# EAGLE design openservo-small (EAGLE 4.16)
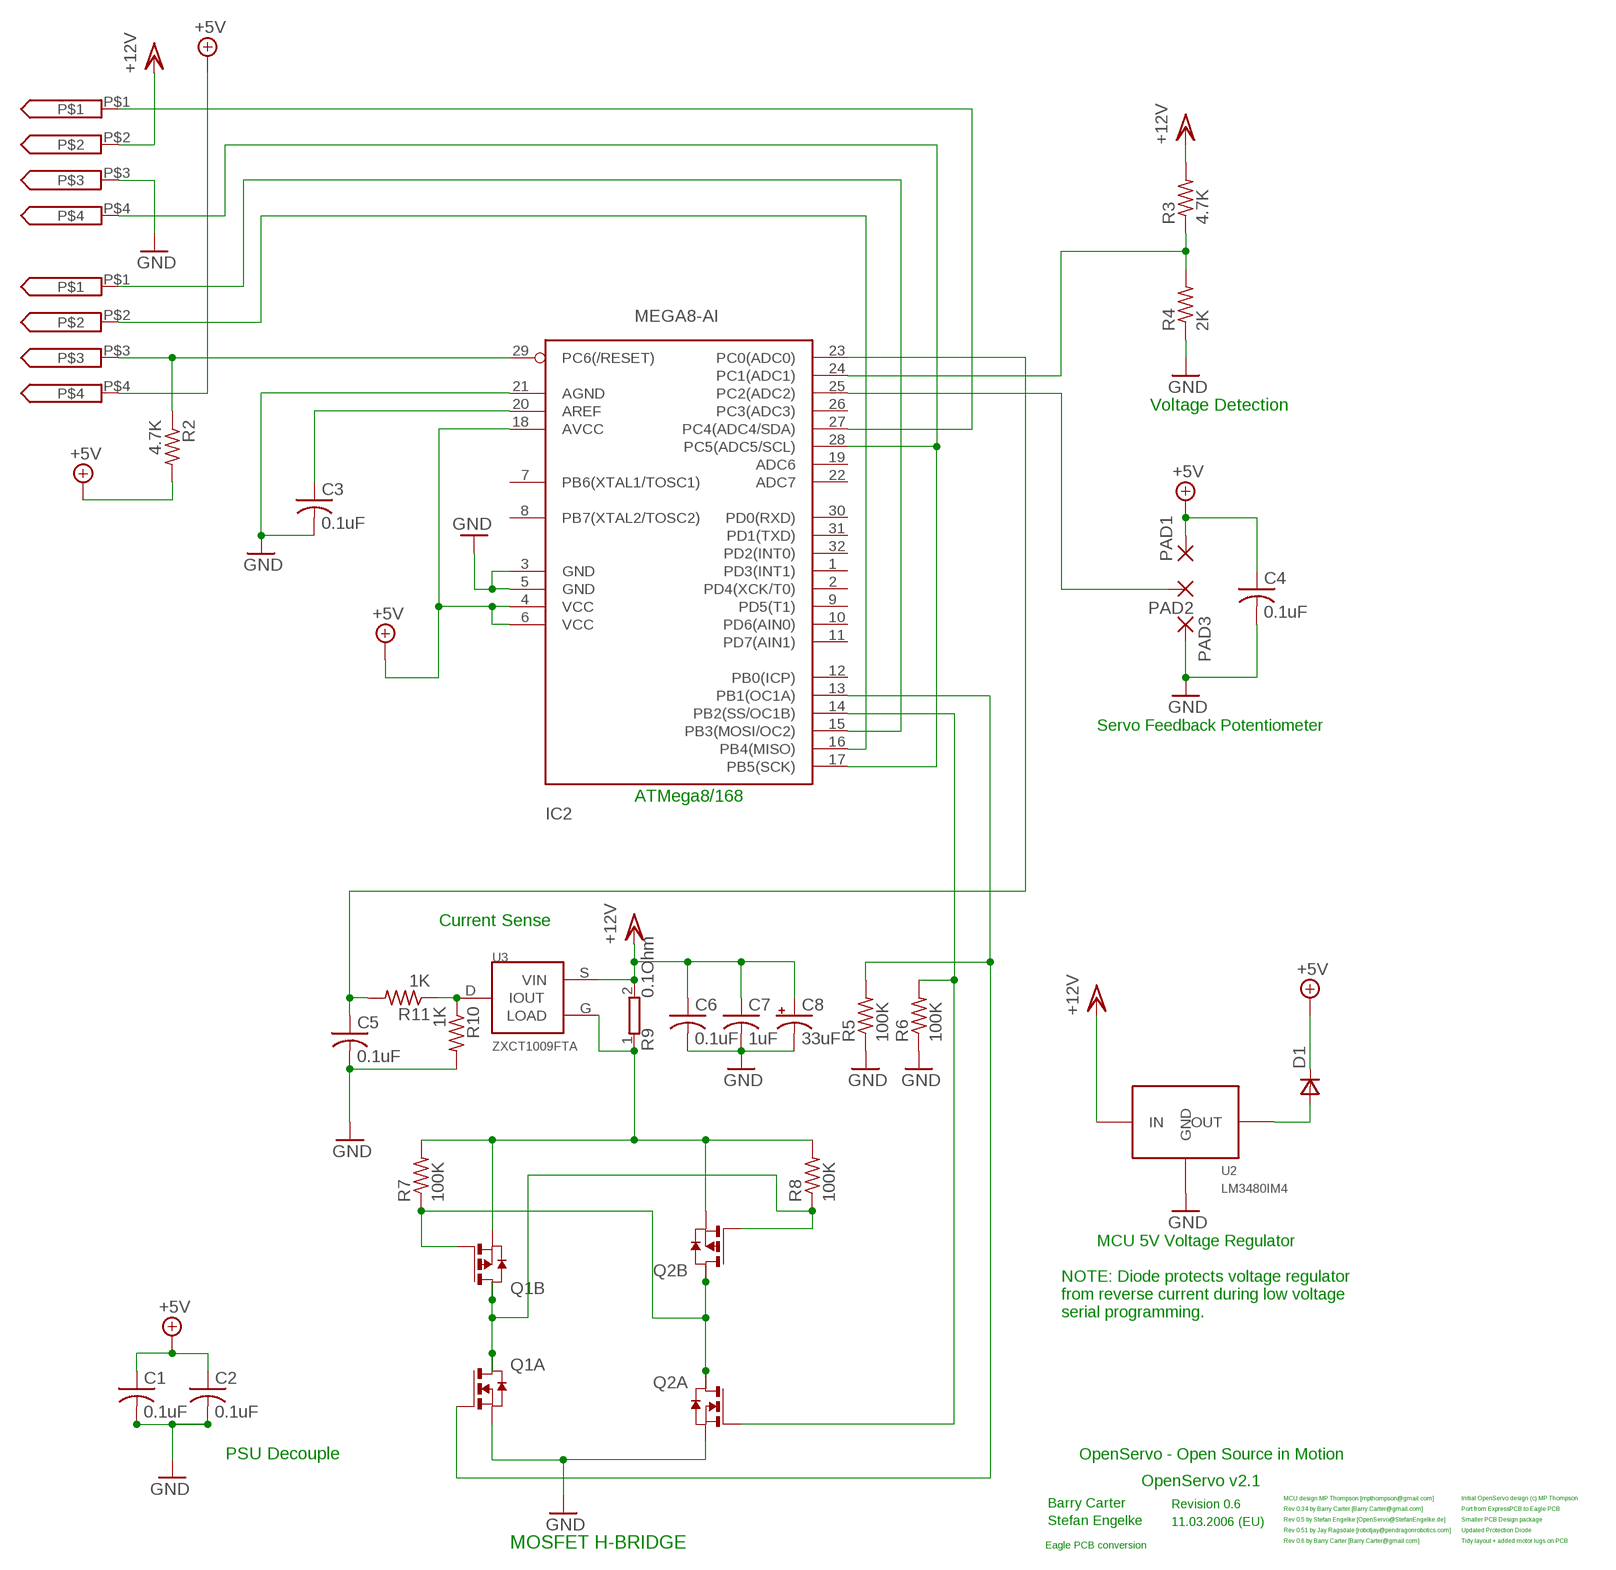
[diagram p0: schematic, sheet 1]

## Parts
C1  0.1uF  C-USC0603  [C0603]
C2  0.1uF  C-USC0603  [C0603]
C3  0.1uF  C-USC0603  [C0603]
C4  0.1uF  C-USC0603  [C0603]
C5  0.1uF  C-USC0603K  [C0603K]
C6  0.1uF  C-USC0603  [C0603]
C7  1uF  C-USC0603  [C0603]
C8  33uF  CPOL-US153CLV-0405  [153CLV-0405]
D1  DSOD323  [SOD323]
IC2  MEGA8-AI  [TQFP32-08]
PAD1  1,6/0,9  [1,6/0,9]
PAD2  1,6/0,9  [1,6/0,9]
PAD3  1,6/0,9  [1,6/0,9]
Q1  PN_MOSFET-SO8  [SO8]
Q2  PN_MOSFET-SO8  [SO8]
R2  4.7K  R-US_R0603  [R0603]
R3  4.7K  R-US_R0603  [R0603]
R4  2K  R-US_R0603  [R0603]
R5  100K  R-US_R0603  [R0603]
R6  100K  R-US_R0603  [R0603]
R7  100K  R-US_R0603  [R0603]
R8  100K  R-US_R0603  [R0603]
R9  0.1Ohm  R1206W  [R1206W]
R10  1K  R-US_R0603  [R0603]
R11  1K  R-US_R0603  [R0603]
U2  LM3480IM4  [SOT-3]
U3  ZXCT1009FTA  [SOT-3]
U$1  4-EDGEVERSION2  4-EDGE  [4-PIN-EDGE]
U$2  4-EDGEVERSION2  4-EDGE  [4-PIN-EDGE]

## Nets
+5V: C1.1 C2.1 C4.1 D1.1(C) IC2.4(VCC) IC2.6(VCC) IC2.18(AVCC) PAD1.1(P) R2.2 U$2.P$4
CURSENSE: C5.1 IC2.23(PC0(ADC0)) R11.2
GND: C1.2 C2.2 C3.2 C4.2 C5.2 C6.2 C7.2 C8.- IC2.3(GND) IC2.5(GND) IC2.21(AGND) PAD3.1(P) Q1.1(A:S) Q2.1(A:S) R4.1 R5.1 R6.1 R10.2 U2.D(GND) U$1.P$3
MISO: IC2.16(PB4(MISO)) U$2.P$2
MOSI: IC2.15(PB3(MOSI/OC2)) U$2.P$1
N$1: D1.2(A) U2.G(OUT)
N$4: Q1.4(B:G) Q2.5(B:D) Q2.6(B:D2) Q2.7(A:D) Q2.8(A:D2) R7.1
N$5: Q1.5(B:D) Q1.6(B:D2) Q1.7(A:D) Q1.8(A:D2) Q2.4(B:G) R8.1
N$10: Q1.3(B:S) Q2.3(B:S) R7.2 R8.2 R9.1 U3.G(LOAD)
N$11: IC2.14(PB2(SS/OC1B)) Q2.2(A:G) R6.2
N$12: R10.1 R11.1 U3.D(IOUT)
N$19: IC2.13(PB1(OC1A)) Q1.2(A:G) R5.2
N$21: C3.1 IC2.20(AREF)
POT: IC2.25(PC2(ADC2)) PAD2.1(P)
RESET: IC2.29(PC6(/RESET)) R2.1 U$2.P$3
SCK/SCL: IC2.17(PB5(SCK)) IC2.28(PC5(ADC5/SCL)) U$1.P$4
SDA: IC2.27(PC4(ADC4/SDA)) U$1.P$1
VCC/2: C6.1 C7.1 C8.+ R3.2 R9.2 U2.S(IN) U3.S(VIN) U$1.P$2 ; supply symbol labelled +12V
VOLTSENSE: IC2.24(PC1(ADC1)) R3.1 R4.2
Unconnected: IC2.1(PD3(INT1)) IC2.2(PD4(XCK/T0)) IC2.7(PB6(XTAL1/TOSC1)) IC2.8(PB7(XTAL2/TOSC2)) IC2.9(PD5(T1)) IC2.10(PD6(AIN0)) IC2.11(PD7(AIN1)) IC2.12(PB0(ICP)) IC2.19(ADC6) IC2.22(ADC7) IC2.26(PC3(ADC3)) IC2.30(PD0(RXD)) IC2.31(PD1(TXD)) IC2.32(PD2(INT0))

## Notes on the sheet
- Voltage Detection
- Servo Feedback Potentiometer
- ATMega8/168
- Current Sense
- MCU 5V Voltage Regulator
- NOTE: Diode protects voltage regulator
- from reverse current during low voltage
- serial programming.
- PSU Decouple | OpenServo - Open Source in Motion
- OpenServo v2.1
- MCU design MP Thompson [mpthompson@gmail.com] | Initial OpenServo design (c) MP Thompson
- Barry Carter | Revision 0.6
- Rev 0.34 by Barry Carter [Barry.Carter@gmail.com] | Port from ExpressPCB to Eagle PCB
- Rev 0.5 by Stefan Engelke [OpenServo@StefanEngelke.de] | Smaller PCB Design package
- Stefan Engelke | 11.03.2006 (EU)
- Rev 0.51 by Jay Ragsdale [robotjay@pendragonrobotics.com] | Updated Protection Diode
- Rev 0.6 by Barry Carter [Barry.Carter@gmail.com] | Tidy layout + added motor lugs on PCB
- MOSFET H-BRIDGE | Eagle PCB conversion

## Library data of the parts
C1-C7 = rcl:C-US: CAPACITOR, American symbol
C8 = rcl:CPOL-US: POLARIZED CAPACITOR, American symbol
D1 = zetex:D: DIODE
IC2 = atmel:MEGA8: MICROCONTROLLER 8 Kbytes FLASH 1 kbytes SRAM 512 bytes EEPROM USART 6-channel 10 bit ADC 2-channel 8 bit ADC Source: avr.lbr
PAD1-PAD3 = wirepad:1,6/0,9: THROUGH-HOLE PAD
Q1 Q2 = zetex:PN_MOSFET-: DUAL N AND P-CHANNEL ENHANCEMENT MODE MOSFET source ZXMD63C02.pdf from http://www.zetex.com/
R2-R8 R10 R11 = rcl:R-US_: RESISTOR, American symbol
R9 = openservo:R1206W
U2 = openservo:LM3480IM4
U3 = openservo:ZXCT1009FTA
U$1 U$2 = openservo:4-EDGE

## Board
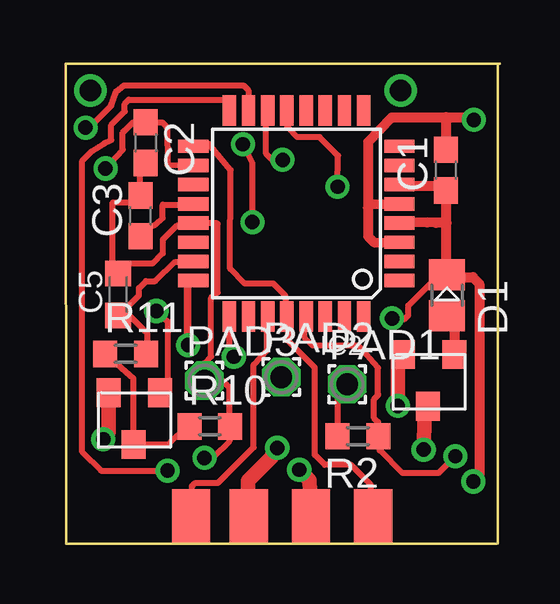
[diagram p1: board, top side]
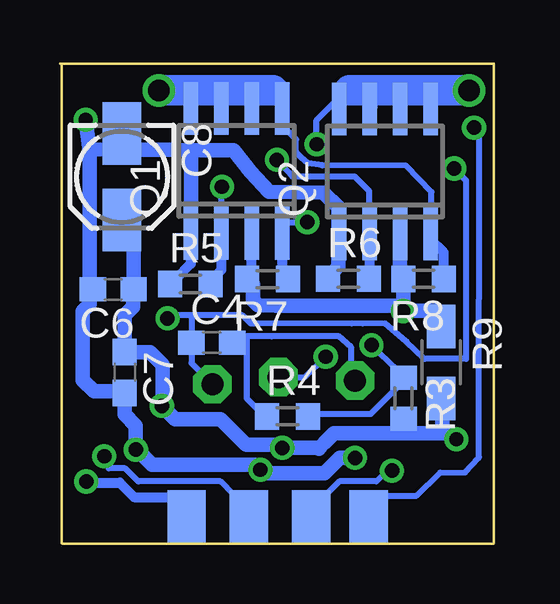
[diagram p2: board, bottom side, seen from below]

Size 18.1 x 19.99 mm. Coordinates in mm from the lower left corner, seen from the top.
Outline: 0.02,0 17.99,0
Outline: 0,19.87 0.01,0.03
Outline: 18.02,19.91 18.03,13.53
Outline: 18.03,13.53 18.03,13.5
Outline: 18.03,13.53 18.03,0
Outline: 18.1,19.99 0,19.99 0,19.87
Outline: 0,19.87 0,19.83
Copper layers (1*16): Top 0.035mm / dielectric 1.5mm / Bottom 0.035mm
Design rules "8mils": minimum track width 10mil, minimum drill 0.6mm, track to track 8mil, track to pad 8mil, pad to pad 8mil, via to via 8mil, smd to smd 8mil, copper to edge 10mil, drill to drill 10mil, minimum pad ring 10mil, minimum via ring 8mil, stop-mask expansion 0mil, vias tented up to drill 0mil, thermal gap 10mil
tKeepout: area 0.1,0 to 2.1,2; area 15.8,0 to 17.8,2

### Footprints (pad centres in the part's own frame; a part is rotated, then mirrored left to right if it is on the bottom)
C0603 = smd 1.1 x 1: 1 -0.85,0; 2 0.85,0
C0603K = smd 1.05 x 1.08: 1 -0.875,0; 2 0.875,0
153CLV-0405 = smd 2.6 x 1.6: + 1.8,0; - -1.8,0
C0805 = smd 1.3 x 1.5: 1 -0.85,0; 2 0.85,0
TQFP32-08 = smd 1.27 x 0.559: 1 -4.293,2.8; 2 -4.293,2; 3 -4.293,1.2; 4 -4.293,0.4; 5 -4.293,-0.4; 6 -4.293,-1.2; 7 -4.293,-2; 8 -4.293,-2.8; 17 4.293,-2.8; 18 4.293,-2; 19 4.293,-1.2; 20 4.293,-0.4; 21 4.293,0.4; 22 4.293,1.2; 23 4.293,2; 24 4.293,2.8 | smd 0.559 x 1.27: 9 -2.8,-4.293; 10 -2,-4.293; 11 -1.2,-4.293; 12 -0.4,-4.293; 13 0.4,-4.293; 14 1.2,-4.293; 15 2,-4.293; 16 2.8,-4.293; 25 2.8,4.293; 26 2,4.293; 27 1.2,4.293; 28 0.4,4.293; 29 -0.4,4.293; 30 -1.2,4.293; 31 -2,4.293; 32 -2.8,4.293
1,6/0,9 = drill 0.914 pad 1.6 octagon: 1 0,0
SO8 = smd 0.6 x 2.2: 1 -1.905,-2.6; 2 -0.635,-2.6; 3 0.635,-2.6; 4 1.905,-2.6; 5 1.905,2.6; 6 0.635,2.6; 7 -0.635,2.6; 8 -1.905,2.6
R0603 = smd 1 x 1.1: 1 -0.85,0; 2 0.85,0
R1206W = smd 1.8 x 1.2: 1 -1.499,0; 2 1.499,0
SOT-3 = smd 1 x 1.2: D -0.038,-0.927; G 1.067,1.232; S -1.079,1.232
4-PIN-EDGE = smd 2.2 x 1.6: P$1 1.2,4.2; P$2 1.2,1.8; P$3 1.2,-0.8; P$4 1.2,-3.4

### Placement (x,y rotation side)
C1  15.86,15.56 90 top
C2  3.34,16.7 270 top
C3  3.12,13.65 90 top
C4  11.76,8.37 0 bottom
C5  2.19,10.38 90 top
C6  15.87,10.6 180 bottom
C7  15.4,7.13 270 bottom
C8  15.51,15.29 270 bottom
D1  [C0805]  15.9,10.35 270 top
IC2  9.63,13.75 180 top
PAD1  11.74,6.64 0 top
PAD2  8.99,6.94 0 top
PAD3  5.79,6.79 0 top
Q1  10.73,15.53 0 bottom
Q2  4.55,15.5 0 bottom
R2  12.19,4.47 180 top
R3  3.77,6.06 270 bottom
R4  8.61,5.3 0 bottom
R5  12.66,10.82 0 bottom
R6  6.06,11.03 0 bottom
R7  9.44,11.02 180 bottom
R8  2.93,11.03 180 bottom
R9  2.2,7.55 270 bottom
R10  6.01,4.88 0 top
R11  2.5,7.91 0 top
U2  15.15,6.65 0 top
U3  2.86,5.06 0 top
U$1  9.43,-0.04 90 top
U$2  9.42,2.33 270 bottom

### Tracks (layer width: path | path; a pad name or v marks a point on that pad's centre or on a via)
+5V  (via drill 0.6)
  Top 0.254: IC2.18 4.24,15.78 4.23,17.33 4.23,17.35 4.02,17.55 C2.1 2.8,17.55 2.46,17.21 2.38,17.13 2.38,16.42 v1.66,15.63 | v13.61,9.38 14.13,9.35 14.29,9.51 14.29,9.91 15.31,10.94 | 15.45,11.13 15.45,11.14 | 15.45,11.13 15.88,11.34 | 15.31,10.94 15.45,11.08 15.45,11.13 | PAD1.1 11.75,6.66 | PAD1.1 | R2.2 11.34,6.25 PAD1.1 | D1.1 15.9,11.12 15.71,10.94 15.31,10.94
  Top 0.406: 15.88,11.34 15.51,10.95 | 15.88,11.34 15.53,11.03 | 15.88,11.34 15.88,13.36 | 15.88,13.36 15.88,14.63 | 15.88,14.63 15.8,14.67 | 15.88,13.36 15.46,13.36 15.08,13.38 IC2.4 | 15.79,14.78 15.79,14.89 13.91,14.89 IC2.6 | 15.79,14.78 C1.1 | 15.79,14.78 15.63,14.63 15.88,14.63 | v17,2.59 17.25,2.75 17.25,10.84 16.99,11.1 16.19,11.1 16.03,11.26 15.97,11.2 D1.1
  Bottom 0.254: v1.66,15.63 1.16,15.12 1.16,7.7 2.9,7.7 3.65,8.41 4.55,9.18 5.47,9.17 5.93,9.18 9.99,9.17 10.13,9.17 10.48,9.51 12.7,9.51 | 13.62,9.38 13.65,9.35 | 13.62,9.38 v13.61,9.38 | 12.7,9.51 13.49,9.51 13.62,9.38 | 12.7,9.51 12.61,9.43 C4.1 12.61,7.52 PAD1.1
  Bottom 0.406: U$2.P$4 12.77,0.68 13.3,1.21 13.3,1.74 13.5,1.94 15.01,1.94 15.6,2.54 17,2.54 v17,2.59
CURSENSE
  Top 0.254: IC2.23 5.62,11.74 4.57,11.74 3.73,10.94 3.35,10.94 3.06,10.64 3.06,10.34 2.44,9.72 | C5.1 2.34,9.65 2.34,9.72 2.44,9.72 | R11.2 3.54,8.21 3.39,8.21 3.39,8.76 2.44,9.72
GND  (via drill 0.6)
  Top 0.254: 3.1,14.23 3.15,14.38 C3.2 | C2.2 3.1,15.57 3.1,14.23 | 3.1,14.23 1.97,14.21 1.97,11.35 | C5.2 2.53,11.26 | 1.97,11.35 2.27,11.34 | 6.34,13.32 6.34,10.47 6.07,10.25 6.07,7.8 5.79,7.52 PAD3.1 6.54,6.79 6.83,6.5 6.83,5.07 6.86,5.03 R10.2 6.83,4.91 6.83,4.27 6.12,3.57 v5.79,3.57 | C5.2 2.08,11.35 1.97,11.35 | C5.2 2.2,11.33 2.53,11.66 3.62,11.66 4.05,12.09 4.05,12.66 4.62,13.23 5.18,13.23 5.27,13.32 IC2.21 5.32,13.34 | 5.5,13.39 5.55,13.34 5.35,13.31 5.32,13.34 | 6.34,13.32 6.32,13.34 5.32,13.34 | 5.32,13.34 5.25,13.34 | 6.34,13.32 6.3,13.29 6.3,12.89
  Top 0.406: R10.2 | IC2.3 12.89,12.54 12.61,12.82 12.61,13.92 | 12.61,13.92 12.61,16.73 13.59,17.74 15.88,17.74 | IC2.5 12.65,14.14 12.61,13.92 | v17.02,17.65 17.02,17.65 16.99,17.61 16.85,17.74 15.88,17.74 | 15.88,17.74 15.88,17.77 15.86,17.75 C1.2
  Top 0.6: U$1.P$3 10.17,2.63 9.68,3.13 v9.74,3.07
  Top 0.61: U2.D 14.96,5.3 v14.93,3.92
  Bottom 0.254: 10.31,8.24 10.31,8.63 9.26,8.63 6.45,8.63 5.95,8.18 5.95,6.89 5.85,6.79 PAD3.1 | 10.31,8.24 10.31,6.05 9.5,5.24 9.46,5.28 R4.1 9.49,5.3 9.5,5.29 | 10.31,8.24 10.3,8.24 10.3,8.27 C4.2 | Q2.1 6.35,13.01 6.35,13.44 6.4,13.39 6.4,13.34 | 6.4,13.34 6.4,13.09 6.65,13.34 6.65,13.59 6.4,13.34 | C6.2 16.83,10.62 16.86,10.69
  Bottom 0.406: Q1.1 12.64,12.62 12.64,11.66 13.29,10.99 13.48,10.85 13.5,10.72 R5.1
  Bottom 0.61: C8.- 15.36,16.91 15.71,17.77 | 15.71,17.77 15.15,16.52 | 6.49,13.29 6.49,14.02 7.1,14.62 9.38,14.65 10.15,15.48 10.86,16.4 12.62,16.4 | 6.49,13.29 6.45,13.25 Q2.1 6.45,13.32 6.49,13.29 | R6.1 6.7,11.33 6.49,11.55 6.49,13.29 | 12.62,16.4 13.17,16.41 14.97,16.41 | 14.97,16.41 15.59,17.77 15.71,17.77 | 12.62,16.4 12.69,16.38 12.64,16.33 Q1.1 | 14.97,16.41 16.79,16.42 16.8,16.3 | 16.8,16.3 16.86,16.23 16.86,10.69 | 16.8,16.3 16.86,16.36 v17.02,17.65 | 16.85,10.7 C6.2 | 16.85,10.7 16.8,10.69 | 9.76,3.07 v9.74,3.07 | 9.76,3.07 9.97,3.29 14.25,3.29 14.92,3.96 14.93,3.95 v14.93,3.92 14.93,4.92 15.4,5.38 C7.2 15.5,6.28 15.56,6.34 16.67,6.34 17.14,6.81 17.14,9.67 16.85,9.97 16.85,10.7 | 9.76,3.07 9.6,3.07 9.45,2.92 7.06,2.92 6.42,3.57 v5.79,3.57
MISO  (via drill 0.6)
  Top 0.254: IC2.16 6.74,17.81 6.74,18.48 6.85,17.77 6.95,17.96 6.66,18.5 2.63,18.5 2.46,18.33 2.46,18.01 1.91,17.45 1.91,16.82 1.59,16.66 1.08,16.34 0.7,15.96 0.7,3.81 1.47,3.04 v4.25,3.04
  Bottom 0.254: 7.52,0.64 U$2.P$2 | 7.53,0.71 7.34,0.91 6.95,1.3 6.95,2.09 6.45,2.59 4.9,2.59 4.45,3.04 v4.25,3.04
  Bottom 0.61: 7.52,1.02 7.4,0.91 7.34,0.91 | 7.52,1.02 7.52,0.64 | 7.52,1.02 7.53,1.03
MOSI  (via drill 0.6)
  Top 0.254: IC2.15 7.58,17.81 7.56,18.47 | 7.65,18.34 7.62,18.88 7.41,19.09 2.43,19.09 2.1,18.84 1.91,18.24 1.11,17.45 v0.83,17.33
  Top 0.406: 7.56,18.47 7.6,18.27 7.65,18.34
  Bottom 0.254: 5.03,0.68 U$2.P$1 5.02,1.35 5.12,1.82 5.16,2 3.21,2 2.25,2.94 2.25,2.96 1.21,2.97 0.64,3.57 0.62,3.6 0.61,16.74 0.61,16.95 0.59,17.09 v0.83,17.33 | 4.93,0.71 5,0.64 5.05,0.59
  Bottom 0.61: U$2.P$1 5.04,1.04 5,1.01 5,0.64
N$1
  Top 0.406: 15.9,9.53 D1.2 16.22,8.99 U2.G
N$4  (via drill 0.6, 0.9)
  Top 0.254: v7.79,13.39 7.79,15.86 v7.39,16.64
  Bottom 0.254: Q1.4 8.8,13.72 8.65,13.39 v7.79,13.39 | 6.45,18.59 6.42,18.62 7.39,17.65 v7.39,16.64 | 6.45,18.59 6.03,18.88 | 5.4,18.88 5.25,18.94 | Q2.8 6.51,18.09 6.45,18.59
  Bottom 0.406: R7.1 8.89,10.96 8.72,10.88 8.83,11.33 Q1.4
  Bottom 0.61: Q2.6 3.89,18.7 3.86,18.73 | Q2.8 6.45,18.21 | Q2.7 5.15,18.24 5.15,18.94 5.25,18.94 3.95,18.94 3.9,18.89 3.9,18.22 Q2.6 | Q2.6 3.9,18.94 2.65,18.94 Q2.5
  Bottom 1.27: v1.03,18.88 5.4,18.88 6.03,18.88
N$5  (via drill 0.9)
  Bottom 0.254: Q2.4 2.64,13.39 2.6,13.35 2.6,14.64 3.67,15.74 7.16,15.76 7.75,15.84 8.03,16.08 8.25,16.3 8.25,16.84 8.8,17.39 | 8.89,18.09 Q1.5
  Bottom 0.406: Q2.4 2.64,12.68 2.1,12.13 2.1,11.34 2.08,11.33 R8.1 | Q1.8 12.54,18.09 12.7,18.72 12.7,18.88 | 8.8,17.39 8.89,17.29 8.89,18.09 | Q1.5 8.89,18.24 9.21,18.88 | 10.16,18.88 10.16,18.56 Q1.6 | 11.43,18.88 11.43,18.72 Q1.7
  Bottom 1.27: 9.21,18.88 10.16,18.88 11.43,18.88 12.7,18.88 v13.97,18.88
N$10  (via drill 0.6)
  Top 0.254: U3.G 4.25,6.71 4.25,9.25 v3.78,9.69
  Bottom 0.254: v3.78,9.69 3.87,9.9 | 10.11,13.42 10.14,13.39 10.15,13.39 10.15,12.98 Q1.3
  Bottom 0.406: R7.2 10.1,11.16 10.1,12.19 10.15,12.59 10.15,12.89 10.14,12.89 Q1.3
  Bottom 0.6: 3.8,9.7 3.58,9.7 | 3.8,9.7 3.87,9.9 9.09,9.9 | 3.8,9.7 v3.78,9.69 3.8,11.31 arc90 R8.2 arc90 3.79,11.32 3.91,11.32 Q2.3
  Bottom 0.61: v3.78,9.69 3.75,9.82 3.75,9.69 2.35,9.69 2.35,9.15 R9.1 | 9.09,9.9 9.85,9.94 10.05,10.15 10.05,10.81 R7.2
N$11  (via drill 0.6)
  Top 0.254: IC2.14 8.36,17.79 8.36,16.24 8.61,15.99 v9.05,15.99
  Bottom 0.254: Q2.2 5.2,12.92 5.2,14.69 5.8,15.29 8.4,15.29 v9.05,15.99
  Bottom 0.406: R6.2 5.08,11.33 5.18,11.43 Q2.2
N$12
  Top 0.254: R11.1 2.83,6.87 2.83,4.19 U3.D 4.3,4.13 5.08,4.91 5.11,4.88 R10.1
N$19  (via drill 0.6)
  Top 0.254: v11.34,14.87 11.36,16.17 10.59,16.94 9.65,16.94 9.25,17.34 9.25,18.07 | 9.14,17.76 9.16,17.77 IC2.13 9.25,18.07 | 9.25,18.07 9.25,18.09
  Bottom 0.254: Q1.2 11.37,13.99 v11.34,14.87
  Bottom 0.406: R5.2 11.86,10.67 11.85,10.89 11.75,11.02 11.37,11.41 Q1.2
N$21
  Top 0.254: 5.25,14.16 IC2.20 5.22,14.12 4.05,14.12 4.05,13.56 3.75,13.29 3.43,13.17 C3.1
POT  (via drill 0.6)
  Top 0.254: IC2.25 6.87,9.42 6.83,9.04 6.83,7.97 v7.01,7.78
  Bottom 0.254: v7.01,7.78 7.89,6.94 8.65,6.94 | 8.65,6.94 9.03,6.94 | 8.65,6.94 PAD2.1
RESET  (via drill 0.6)
  Top 0.254: IC2.29 9.96,9.2 9.97,9.2 9.97,8.59 10.31,8.24 12.2,8.24 13.03,7.32 13.02,6.24 13.02,6.19 12.86,6.02 12.86,5.23 13.02,5.06 13.02,4.6 13.02,4.59 13.04,4.57 R2.1 13.02,4.43 13.1,4.35 13.1,3.89 14.05,2.94 15.55,2.94 v16.25,3.64
  Bottom 0.254: U$2.P$3 10.85,1.76 10.85,2.04 11.4,2.59 14.83,2.59 15.37,3.14 16.05,3.14 16.25,3.35 v16.25,3.64
SCK/SCL
  Top 0.254: U$1.P$4 12.71,2.46 11.9,3.28 10.81,3.28 10.39,3.7 10.39,7.33 9.28,8.43 9.28,9.2 9.27,9.21 IC2.28 9.16,10.33 8.66,10.83 7.47,10.83 6.86,11.44 6.88,15.56 5.93,16.68 5.24,16.68 IC2.17
SDA
  Top 0.254: U$1.P$1 5.27,2.27 5.27,2.4 5.4,2.53 6.35,2.53 7.83,4.01 7.83,7.45 8.41,8.08 8.41,8.09 8.41,9.45 IC2.27 8.38,9.19
VCC/2  (via drill 0.6)
  Top 0.6: U3.S 1.74,6.32 | U$1.P$2 7.6,2.62 7.73,2.75 8.57,3.58 v8.83,3.99
  Top 0.61: U2.S 13.85,7.66 v13.85,5.74 | v1.57,4.35 1.57,4.41 1.78,4.63 U3.S
  Bottom 0.6: 2.27,5.74 2.27,5.61
  Bottom 0.61: 2.15,6.25 2.15,6.32 | 2.25,5.79 2.27,5.74 | 2.25,5.79 2.15,6.16 2.15,6.25 | 2.25,5.79 | 2.25,5.79 | R9.2 2.25,6.15 2.25,5.79 | 7.07,4.19 | 7.07,4.19 6.67,4.59 3.81,4.59 | 7.07,4.19 | 7.07,4.19 7.3,3.96 | 7.3,3.96 | 7.3,3.96 7.33,3.99 v8.83,3.99 8.83,4.05 8.89,4.12 10.32,4.12 10.37,4.17 10.38,4.17 11.4,5.19 13.3,5.19 v13.85,5.74 13.85,5.82 13.81,5.86 13.81,7.45 14.34,7.98 C7.1 15.4,9.51 15.05,9.86 15.05,10.43 15.08,10.46 15.02,10.52 C6.1 15.02,13.11 15.36,13.44 C8.+ | v1.57,4.35 1.66,4.35 1.91,4.59 2.06,4.59 | 2.06,4.59 3.81,4.59 | 3.81,4.59 3.81,4.75 3.77,4.79 R3.2 | 2.06,4.59 2.06,4.67 2.15,4.75 2.15,6.25
VOLTSENSE  (via drill 0.6)
  Top 0.254: IC2.24 5.19,10.92
  Top 0.305: v5.11,8.27 5.08,8.29 5.08,10.8 5.19,10.92
  Bottom 0.254: v5.11,8.27 4.01,7.22 3.96,7.14 3.96,6.99 R3.1 3.73,6.95 3.71,6.95 3.71,6.83 5.14,5.4 7.48,5.4 R4.2